# EAGLE schematic OpenAccDemo (EAGLE 6.0)
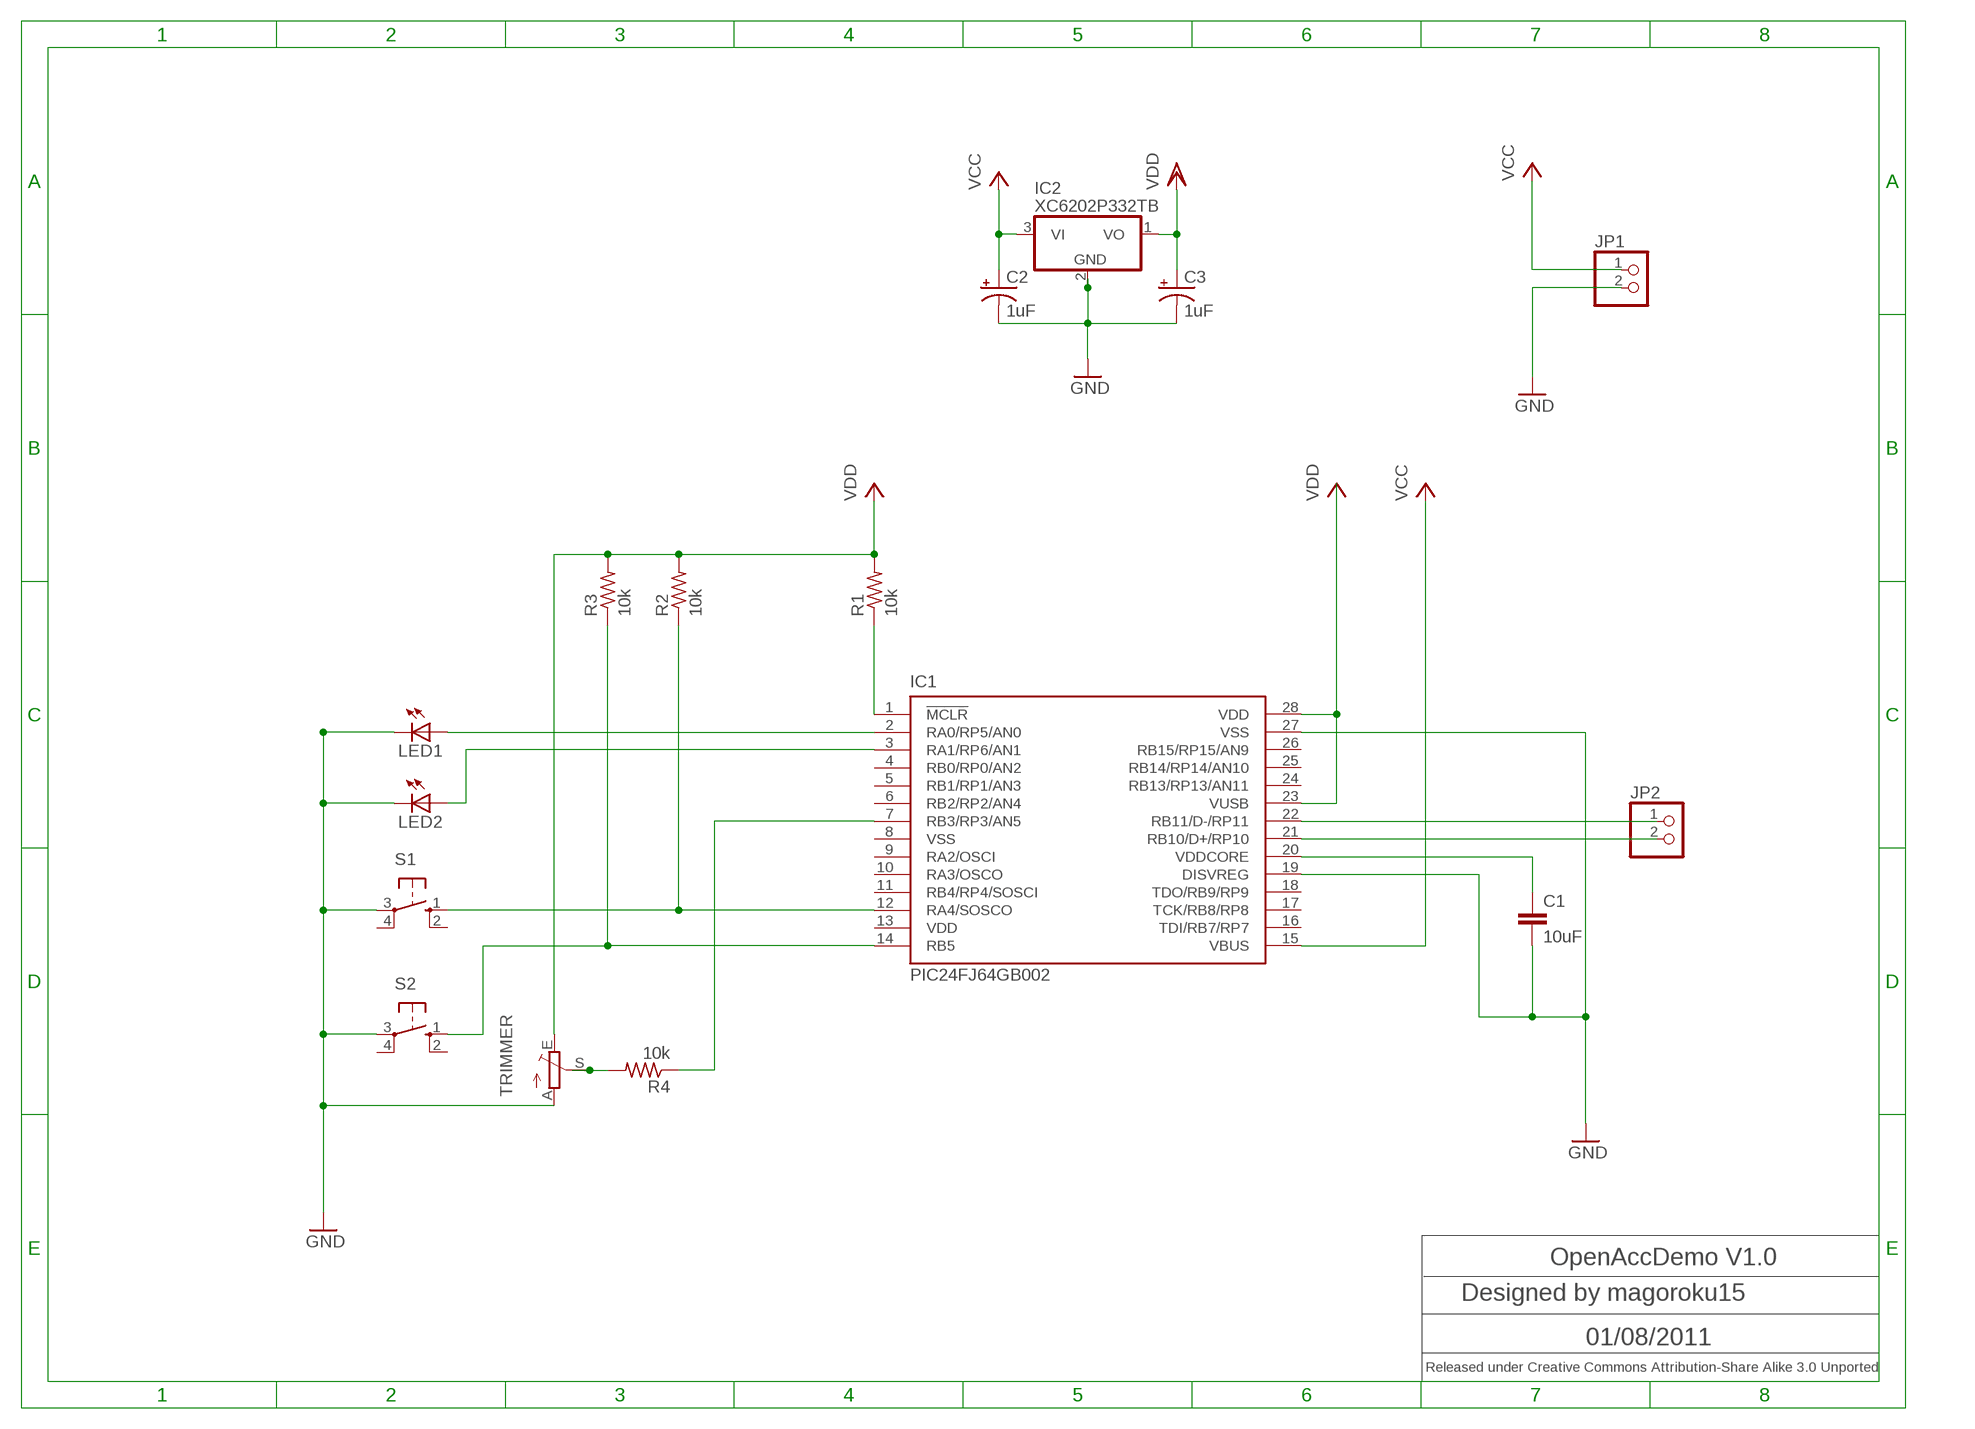
[diagram p0: schematic, sheet 1]

## Parts
C1  10uF  C5/2.5  [C5B2.5]
C2  1uF  CPOL-USE2,5-6E  [E2,5-6E]
C3  1uF  CPOL-USE2,5-6E  [E2,5-6E]
IC1  PIC24FJ64GB002  [DIL28-3]
IC2  XC6202P332TB  78L08Z  [TO92]
JP1  PINHD-1X2  [1X02]
JP2  PINHD-1X2  [1X02]
LED1  LED3MM  [LED3MM]
LED2  LED3MM  [LED3MM]
R1  10k  R-US_0204/5  [0204/5]
R2  10k  R-US_0204/5  [0204/5]
R3  10k  R-US_0204/5  [0204/5]
R4  10k  R-US_0204/5  [0204/5]
S1  10-XX  [B3F-10XX]
S2  10-XX  [B3F-10XX]
TRIMMER  TRIM_EU-B25P  [B25P]

## Nets
GND: C1.2 C2.- C3.- IC1.19(DISVREG) IC1.27(VSS) IC2.2(GND) JP1.2 LED1.K(C) LED2.K(C) S1.3(P) S2.3(P) TRIMMER.A
N$1: IC1.21(RB10/D+/RP10) JP2.2
N$2: IC1.14(RB5) R3.1 S2.1(S)
N$3: IC1.1(!MCLR) R1.1
N$4: C1.1 IC1.20(VDDCORE)
N$6: IC1.7(RB3/RP3/AN5) R4.1
N$7: IC1.2(RA0/RP5/AN0) LED1.A
N$8: IC1.22(RB11/D-/RP11) JP2.1
N$9: IC1.3(RA1/RP6/AN1) LED2.A
N$10: IC1.12(RA4/SOSCO) R2.1 S1.1(S)
N$11: R4.2 TRIMMER.S
VCC: C2.+ IC1.15(VBUS) IC1.23(VUSB) IC1.28(VDD) IC2.3(VI) JP1.1 R1.2 R2.2 R3.2 TRIMMER.E ; supply symbol labelled VDD
VDD: C3.+ IC2.1(VO)
Unconnected: IC1.4(RB0/RP0/AN2) IC1.5(RB1/RP1/AN3) IC1.6(RB2/RP2/AN4) IC1.9(RA2/OSCI) IC1.10(RA3/OSCO) IC1.11(RB4/RP4/SOSCI) IC1.16(TDI/RB7/RP7) IC1.17(TCK/RB8/RP8) IC1.18(TDO/RB9/RP9) IC1.24(RB13/RP13/AN11) IC1.25(RB14/RP14/AN10) IC1.26(RB15/RP15/AN9) S1.2(S1) S1.4(P1) S2.2(S1) S2.4(P1)

## Notes on the sheet
- OpenAccDemo V1.0
- Designed by magoroku15
- 01/08/2011
- Released under Creative Commons Attribution-Share Alike 3.0 Unported

## Power pins joined to a net without a drawn wire
VDD: IC1.13(VDD)
VSS: IC1.8(VSS)

## Library data of the parts
C1 = capacitor-wima:C: CAPACITOR naming: grid - package width
C2 C3 = resistor:CPOL-US: POLARIZED CAPACITOR, American symbol
IC1 = mylibrary:PIC24FJ64GB002: PIC24FJ64GB002 edit this description Auto generated by make-symbol-device-package-bsdl.ulp Rev. 25 Source: PIC24FJ64GB002.bsd
IC2 = linear:78*: Positive VOLTAGE REGULATOR Source: http://cache.national.com/ds/LM/LM78L05.pdf http://www.fairchildsemi.com/ds/LM/LM7805.pdf
JP1 JP2 = pinhead:PINHD-1X2: PIN HEADER
LED1 LED2 = led:LED: LED OSRAM: - CHIPLED LG R971, LG N971, LY N971, LG Q971, LY Q971, LO R971, LY R971 LH N974, LH R974 LS Q976, LO Q976, LY Q976 LO Q996 - Hyper CHIPLED LW Q18S LB Q993, LB Q99A, LB R99A - SideLED LS A670, LO A670, LY A670, LG A670, LP A670 LB A673, LV A673, LT A673, LW A673 LH A674 LY A675 LS A676, LA A676, LO A676, LY A676, LW A676 LS A679, LY A679, LG A679 - Hyper Micro SIDELED® LS Y876, LA Y876, LO Y876, LY Y876 LT Y87S - SmartLED LW L88C, LW L88S LB L89C, LB L89S, LG L890 LS L89K, LO L89K, LY L89K LS L896, LA L896, LO L896, LY L896 - TOPLED LS T670, LO T670, LY T670, LG T670, LP T670 LSG T670, LSP T670, LSY T670, LOP T670, LYG T670 LG T671, LOG T671, LSG T671 LB T673, LV T673, LT T673, LW T673 LH T674 LS T676, LA T676, LO T676, LY T676, LB T676, LH T676, LSB T676, LW T676 LB T67C, LV T67C, LT T67C, LS T67K, LO T67K, LY T67K, LW E67C LS E67B, LA E67B, LO E67B, LY E67B, LB E67C, LV E67C, LT E67C LW T67C LS T679, LY T679, LG T679 LS T770, LO T770, LY T770, LG T770, LP T770 LB T773, LV T773, LT T773, LW T773 LH T774 LS E675, LA E675, LY E675, LS T675 LS T776, LA T776, LO T776, LY T776, LB T776 LHGB T686 LT T68C, LB T68C - Hyper Mini TOPLED® LB M676 - Mini TOPLED Santana® LG M470 LS M47K, LO M47K, LY M47K Source: http://www.osram.convergy.de LUXEON: - LUMILED® LXK2-PW12-R00, LXK2-PW12-S00, LXK2-PW14-U00, LXK2-PW14-V00 LXK2-PM12-R00, LXK2-PM12-S00, LXK2-PM14-U00 LXK2-PE12-Q00, LXK2-PE12-R00, LXK2-PE12-S00, LXK2-PE14-T00, LXK2-PE14-U00 LXK2-PB12-K00, LXK2-PB12-L00, LXK2-PB12-M00, LXK2-PB14-N00, LXK2-PB14-P00, LXK2-PB14-Q00 LXK2-PR12-L00, LXK2-PR12-M00, LXK2-PR14-Q00, LXK2-PR14-R00 LXK2-PD12-Q00, LXK2-PD12-R00, LXK2-PD12-S00 LXK2-PH12-R00, LXK2-PH12-S00 LXK2-PL12-P00, LXK2-PL12-Q00, LXK2-PL12-R00 Source: www.luxeon.com KINGBRIGHT: KA-3528ASYC Source: www.kingbright.com
R1-R4 = resistor:R-US_: RESISTOR, American symbol
S1 S2 = switch-omron:10-XX: OMRON SWITCH; MPN: B3F-1000; OC_FARNELL: 176432; OC_NEWARK: 36M3542
TRIMMER = pot:TRIM_EU-: POTENTIOMETER